# EAGLE design IONA-PSX (EAGLE 9.6.2)
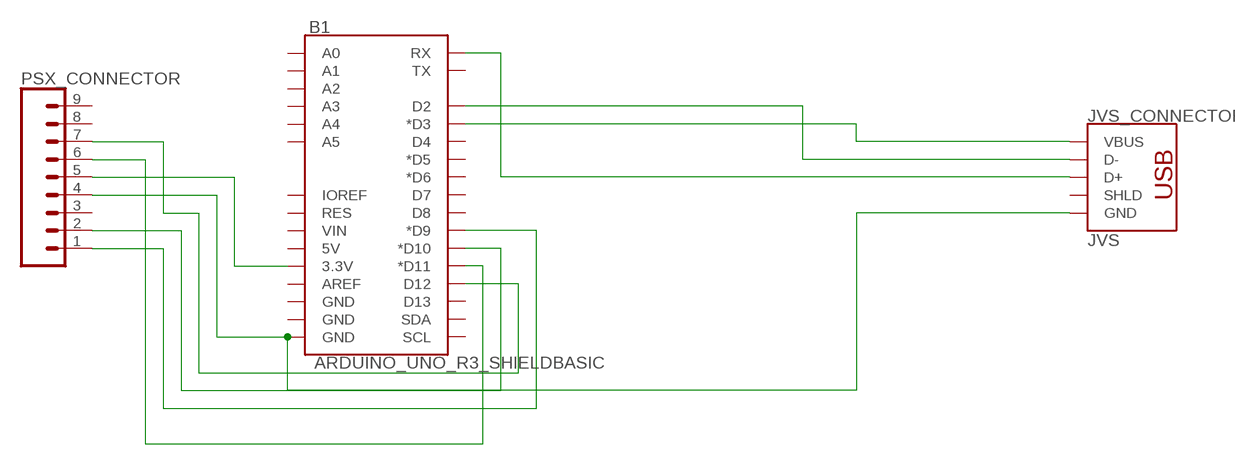
[diagram p0: schematic, sheet 1]

## Parts
B1  ARDUINO_UNO_R3_SHIELDBASIC  [UNO_R3_SHIELD]
JVS_CONNECTOR  JVS  USB_B_PTH  [USB-B-PTH]
PSX_CONNECTOR  CONN_09  [1X09]

## Nets
N$1: B1.D2 JVS_CONNECTOR.D-
N$2: B1.RX JVS_CONNECTOR.D+
N$3: B1.D3(*D3) JVS_CONNECTOR.VBUS
N$4: B1.GND@0(GND) JVS_CONNECTOR.GND PSX_CONNECTOR.4
N$5: B1.D9(*D9) PSX_CONNECTOR.1
N$6: B1.D10(*D10) PSX_CONNECTOR.2
N$8: B1.3.3V PSX_CONNECTOR.5
N$9: B1.D11(*D11) PSX_CONNECTOR.6
N$10: B1.D12 PSX_CONNECTOR.7
Unconnected: B1.5V B1.A0 B1.A1 B1.A2 B1.A3 B1.A4 B1.A5 B1.AREF B1.D4 B1.D5(*D5) B1.D6(*D6) B1.D7 B1.D8 B1.D13 B1.GND@1(GND) B1.GND@2(GND) B1.IOREF B1.RES B1.SCL B1.SDA B1.TX B1.VIN JVS_CONNECTOR.SHLD1(SHLD) JVS_CONNECTOR.SHLD2(SHLD) PSX_CONNECTOR.3 PSX_CONNECTOR.8 PSX_CONNECTOR.9

## Library data of the parts
B1 = SparkFun-Boards:ARDUINO_UNO_R3_SHIELD: Arduino R3 Shield Footprint Shield form compatible with the Arduino Uno R3. SparkFun Products: MG2639 Cellular Shield <https://www.sparkfun.com/products/13120> MIDI Shield <https://www.sparkfun.com/products/12898> R3 Stackable Headers Kit <https://www.sparkfun.com/products/11417>
JVS_CONNECTOR = SparkFun-Connectors:USB_B: USB Type B Connector SparkFun Products: SparkFun Stepoko <https://www.sparkfun.com/products/13899> PTH; PROD_ID: CONN-08278; SF_ID: PRT-00139
PSX_CONNECTOR = SparkFun-Connectors:CONN_09: Multi connection point. Often used as Generic Header-pin footprint for 0.1 inch spaced/style header connections On any of the 0.1 inch spaced packages, you can populate with these: Break Away Headers - Straight <https://www.sparkfun.com/products/116> (PRT-00116) Break Away Male Headers - Right Angle <https://www.sparkfun.com/products/553> (PRT-00553) Female Headers <https://www.sparkfun.com/products/115> (PRT-00115) Break Away Headers - Machine Pin <https://www.sparkfun.com/products/117> (PRT-00117) Break Away Female Headers - Swiss Machine Pin <https://www.sparkfun.com/products/743> (PRT-00743) For SCREWTERMINALS and SPRING TERMINALS visit here: Screw Terimnals on SparkFun.com <https://www.sparkfun.com/search/results?term=Screw+Terminals> (5mm/3.5mm/2.54mm spacing) This device is also useful as a general connection point to wire up your design to another part of your project. Our various solder wires solder well into these plated through hole pads. Hook-Up Wire - Assortment (Stranded, 22 AWG) <https://www.sparkfun.com/products/11375> (PRT-11375) Hook-Up Wire - Assortment (Solid Core, 22 AWG) <https://www.sparkfun.com/products/11367> (PRT-11367) View the entire wire category on our website here <https://www.sparkfun.com/categories/141> Special notes: Molex polarized connector foot print use with SKU : PRT-08231 with associated crimp pins and housings. 1MM SMD Version SKU: PRT-10208 NOTES ON THE VARIANTS LOCK and LOCK_LONGPADS... This footprint was designed to help hold the alignment of a through-hole component (i.e. 6-pin header) while soldering it into place. You may notice that each hole has been shifted either up or down by 0.005 of an inch from it's more standard position (which is a perfectly straight line). This slight alteration caused the pins (the squares in the middle) to touch the edges of the holes. Because they are alternating, it causes a "brace" to hold the component in place. 0.005 has proven to be the perfect amount of "off-center" position when using our standard breakaway headers. Although looks a little odd when you look at the bare footprint, once you have a header in there, the alteration is very hard to notice. Also,if you push a header all the way into place, it is covered up entirely on the bottom side.

## Board
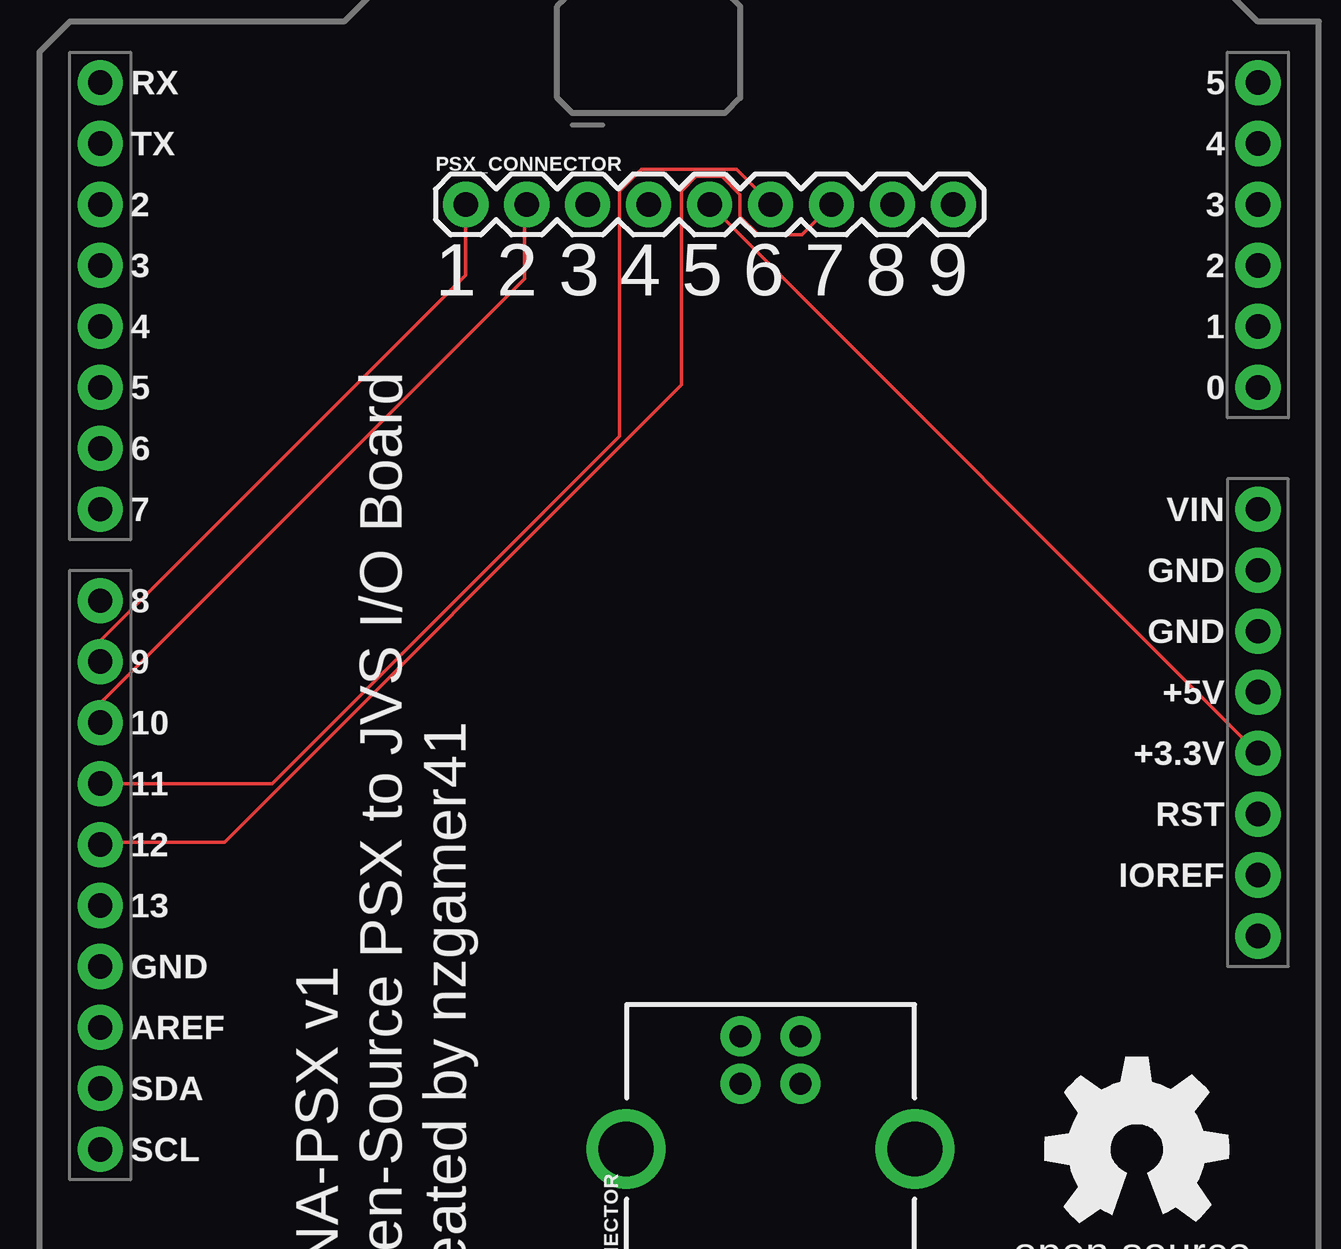
[diagram p1: board, top side]
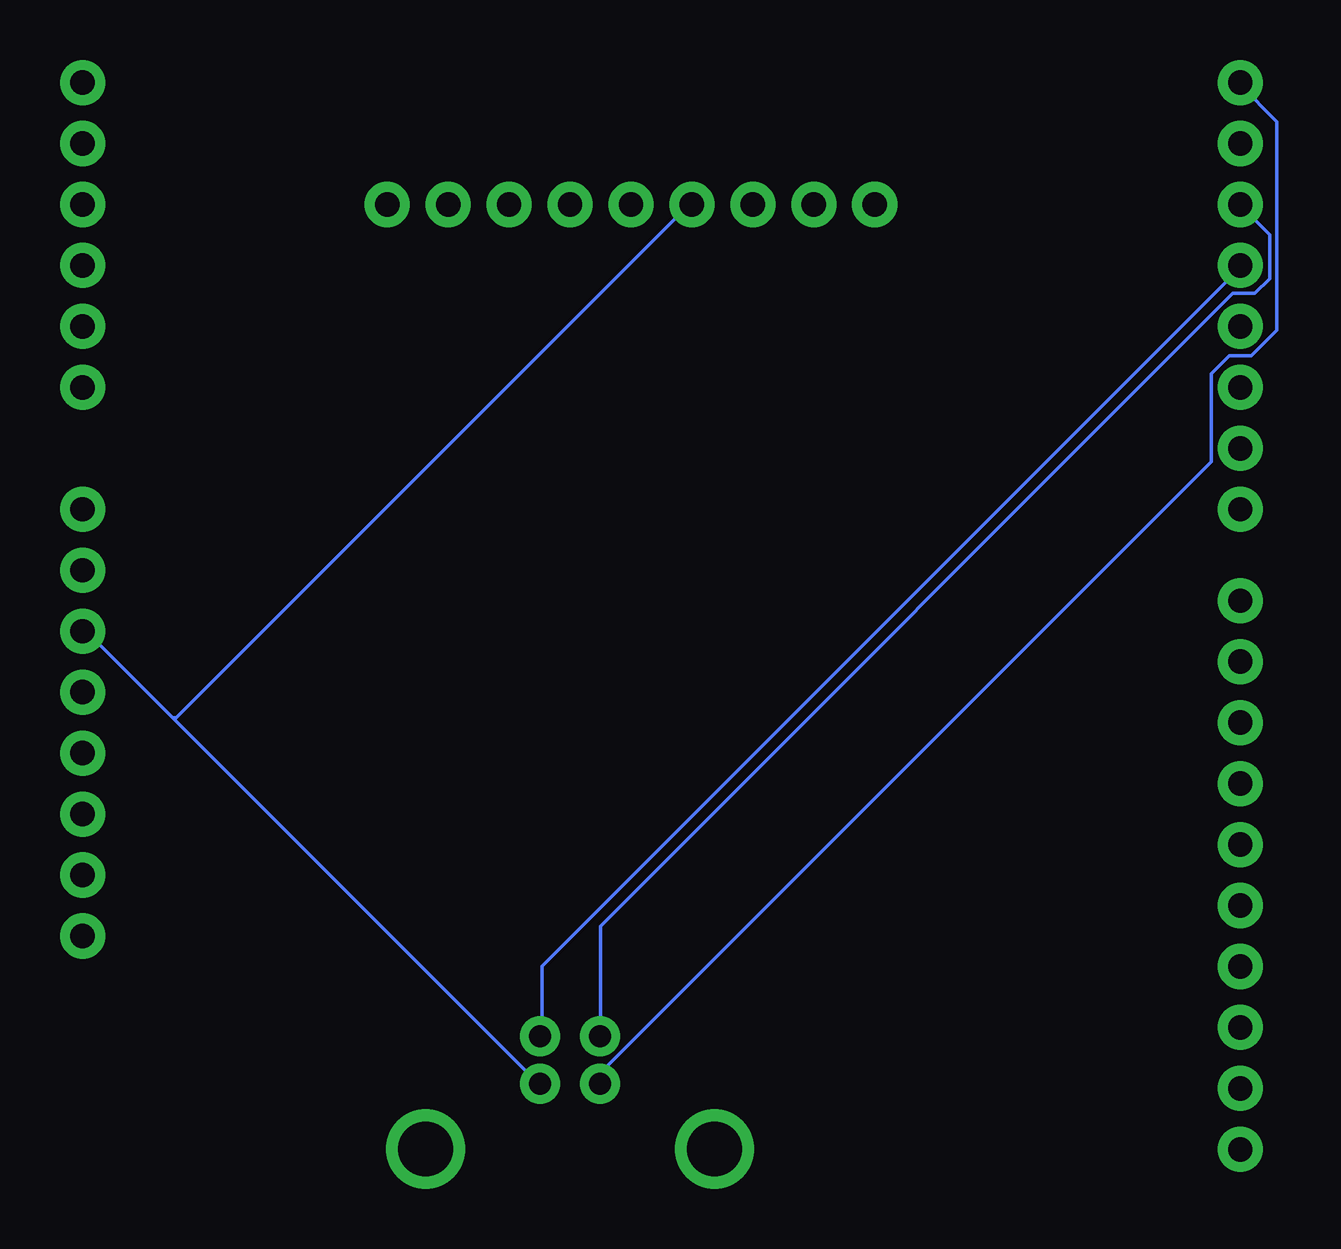
[diagram p2: board, bottom side, seen from below]

No outline drawn. Coordinates in mm, seen from the top.
Copper layers (1*16): Top 0.035mm / dielectric 1.5mm / Bottom 0.035mm
Design rules "default": minimum track width 6mil, minimum drill 0.35mm, track to track 6mil, track to pad 6mil, pad to pad 6mil, via to via 6mil, smd to smd 6mil, copper to edge 40mil, drill to drill 6mil, minimum pad ring 10mil, minimum via ring 8mil, stop-mask expansion 4mil, vias tented up to drill 0mil, thermal gap 10mil

### Footprints (pad centres in the part's own frame; a part is rotated, then mirrored left to right if it is on the bottom)
UNO_R3_SHIELD = drill 1.016 pad 1.88: 3.3V 24.13,-2.54; 5V 24.13,0; A0 24.13,12.7; A1 24.13,15.24; A2 24.13,17.78; A3 24.13,20.32; A4 24.13,22.86; A5 24.13,25.4; AREF -24.13,-13.97; D2 -24.13,20.32; D3 -24.13,17.78; D4 -24.13,15.24; D5 -24.13,12.7; D6 -24.13,10.16; D7 -24.13,7.62; D8 -24.13,3.81; D9 -24.13,1.27; D10 -24.13,-1.27; D11 -24.13,-3.81; D12 -24.13,-6.35; D13 -24.13,-8.89; GND@0 24.13,2.54; GND@1 24.13,5.08; GND@2 -24.13,-11.43; IOREF 24.13,-7.62; NC 24.13,-10.16; RES 24.13,-5.08; RX -24.13,25.4; SCL -24.13,-19.05; SDA -24.13,-16.51; TX -24.13,22.86; VIN 24.13,7.62
USB-B-PTH = drill 0.914 pad 1.676: D+ 4,1.25; D- 5.981,1.25; GND 4,-1.25; VBUS 5.981,-1.25 | drill 2.286: SHLD1 1.282,-6.02; SHLD2 1.282,6.02
1X09 = drill 1.016 pad 1.88: 1 0,0; 2 2.54,0; 3 5.08,0; 4 7.62,0; 5 10.16,0; 6 12.7,0; 7 15.24,0; 8 17.78,0; 9 20.32,0

### Placement (x,y rotation side)
B1  -40.64,45.72 0 top
JVS_CONNECTOR  -36.83,25.4 90 top
PSX_CONNECTOR  -49.53,66.04 0 top
U$1  [OSHW_8MM]  -21.59,26.67 0 top

### Tracks (layer width: path | path; a pad name or v marks a point on that pad's centre or on a via)
N$1
  Bottom 0.152: B1.D2 -64.77,65.99 -65.99,64.77 -65.99,62.94 -65.38,62.33 -64.47,62.33 -38.1,35.97 -38.1,31.39 JVS_CONNECTOR.D-
N$2
  Bottom 0.152: -38.1,29.87 -38.1,29.41 JVS_CONNECTOR.D+ -38.1,29.87 | B1.RX -64.77,71.02 -66.29,69.49 -66.29,60.81 -65.23,59.74 -64.31,59.74 -63.55,58.98 -63.55,55.32 -38.1,29.87
N$3
  Bottom 0.152: JVS_CONNECTOR.VBUS -35.66,31.39 -35.66,34.29 -64.77,63.4 B1.D3
N$4
  Bottom 0.152: -41.81,66.04 PSX_CONNECTOR.4 -41.76,65.99 -20.42,44.65 -20.27,44.65 | -20.27,44.65 -16.61,48.31 B1.GND@0 | -20.27,44.65 -35.51,29.41 JVS_CONNECTOR.GND
N$5
  Top 0.152: B1.D9 -64.77,47.85 -49.53,63.09 PSX_CONNECTOR.1
N$6
  Top 0.152: B1.D10 -64.77,45.26 -47.09,62.94 -47.09,65.99 PSX_CONNECTOR.2
N$8
  Top 0.152: PSX_CONNECTOR.5 B1.3.3V
N$9
  Top 0.152: B1.D11 -57.61,41.91 -43.13,56.39 -43.13,66.6 -42.22,67.51 -38.25,67.51 -36.88,66.14 PSX_CONNECTOR.6
N$10
  Top 0.152: B1.D12 -64.77,39.47 -59.59,39.47 -40.54,58.52 -40.54,66.6 -39.93,67.21 -38.86,67.21 -38.1,66.45 -38.1,65.53 -37.34,64.77 -35.51,64.77 -34.29,65.99 PSX_CONNECTOR.7

### Text on the board
tNames: 1 2 3 4 5 6 7 8 9 | IONA-PSX v1 / Open-Source PSX to JVS I/O Board / Created by nzgamer41